# Altium schematic sheet I2C_system.schdoc: TEBF0808 - I2C System
size A4; DocumentNumber: TEBF0808; Revision: 04; SheetNumber: 21; SheetTotal: 36; Date: 2016-09-29; CompanyName: Trenz Electronic GmbH; Organization: Trenz Electronic GmbH
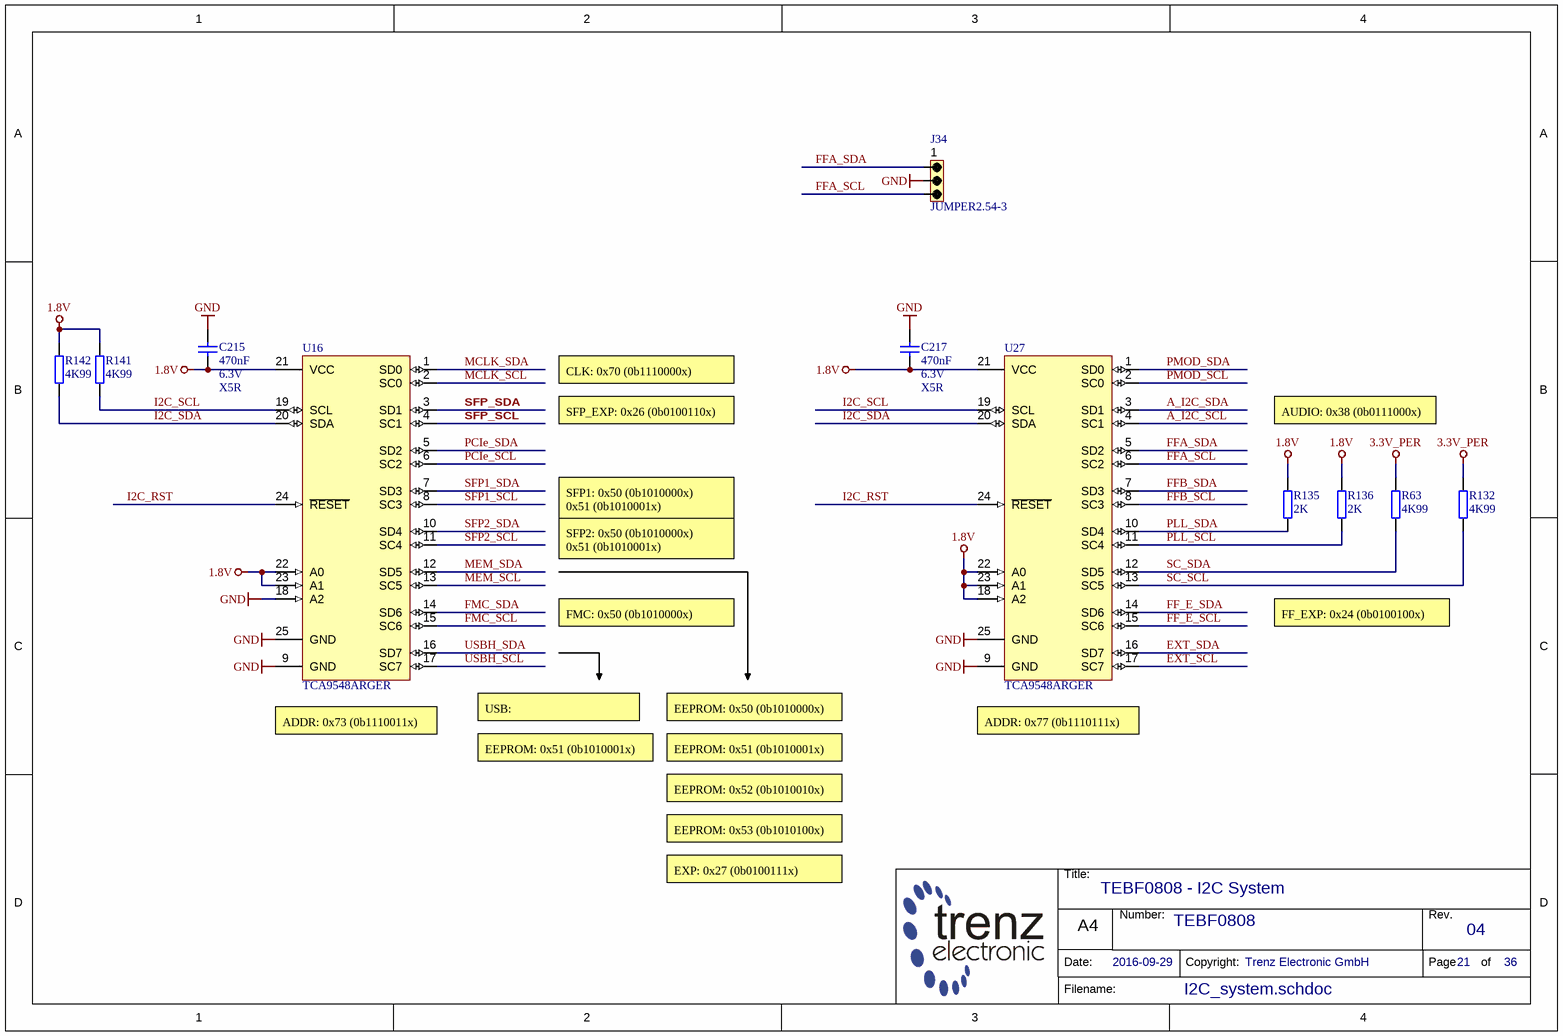
[diagram p0: I2C_system.schdoc]

## Parts
C215  470nF  Voltage: 6.3V  Technology: X5R  [CAPC1005X55N]
C217  470nF  Voltage: 6.3V  Technology: X5R  [CAPC1005X55N]
J34  JUMPER2.54-3  [JUMPER2_54-3]
R63  4K99  [RESC1005X40N]
R132  4K99  [RESC1005X40N]
R135  2K  [RESC1005X40N]
R136  2K  [RESC1005X40N]
R141  4K99  [RESC1005X40N]
R142  4K99  [RESC1005X40N]
U16  TCA9548ARGER  [QFN50P400X400X100-25N-220]
U27  TCA9548ARGER  [QFN50P400X400X100-25N-220]

## Nets
1.8V: C215.2 C217.2 R135.2 R136.2 R141.1 R142.1 U16.21(VCC) U16.22(A0) U16.23(A1) U27.18(A2) U27.21(VCC) U27.22(A0) U27.23(A1)
3.3V_PER: R63.1 R132.1
GND: C215.1 C217.1 J34.2 U16.9(GND) U16.18(A2) U16.25(GND) U27.9(GND) U27.25(GND)
A_I2C_SCL: U27.4(SC1)
A_I2C_SDA: U27.3(SD1)
EXT_SCL: U27.17(SC7)
EXT_SDA: U27.16(SD7)
FF_E_SCL: U27.15(SC6)
FF_E_SDA: U27.14(SD6)
FFA_SCL: J34.3 U27.6(SC2)
FFA_SDA: J34.1 U27.5(SD2)
FFB_SCL: U27.8(SC3)
FFB_SDA: U27.7(SD3)
FMC_SCL: U16.15(SC6)
FMC_SDA: U16.14(SD6)
I2C_RST: U16.24(~{RESET}) U27.24(~{RESET})
I2C_SCL: R141.2 U16.19(SCL) U27.19(SCL)
I2C_SDA: R142.2 U16.20(SDA) U27.20(SDA)
MCLK_SCL: U16.2(SC0)
MCLK_SDA: U16.1(SD0)
MEM_SCL: U16.13(SC5)
MEM_SDA: U16.12(SD5)
PCIe_SCL: U16.6(SC2)
PCIe_SDA: U16.5(SD2)
PLL_SCL: R136.1 U27.11(SC4)
PLL_SDA: R135.1 U27.10(SD4)
PMOD_SCL: U27.2(SC0)
PMOD_SDA: U27.1(SD0)
SC_SCL: R132.2 U27.13(SC5)
SC_SDA: R63.2 U27.12(SD5)
SFP1_SCL: U16.8(SC3)
SFP1_SDA: U16.7(SD3)
SFP2_SCL: U16.11(SC4)
SFP2_SDA: U16.10(SD4)
SFP_SCL: U16.4(SC1)
SFP_SDA: U16.3(SD1)
USBH_SCL: U16.17(SC7)
USBH_SDA: U16.16(SD7)

## Notes on the sheet
- CLK: 0x70 (0b1110000x)
- SFP_EXP: 0x26 (0b0100110x)
- AUDIO: 0x38 (0b0111000x)
- SFP1: 0x50 (0b1010000x)
  0x51 (0b1010001x)
- SFP2: 0x50 (0b1010000x)
  0x51 (0b1010001x)
- FMC: 0x50 (0b1010000x)
- FF_EXP: 0x24 (0b0100100x)
- USB:
- EEPROM: 0x50 (0b1010000x)
- (near U16) ADDR: 0x73 (0b1110011x)
- EEPROM: 0x51 (0b1010001x)
- (near U27) ADDR: 0x77 (0b1110111x)
- EEPROM: 0x53 (0b1010100x)
- EEPROM: 0x52 (0b1010010x)
- EXP: 0x27 (0b0100111x)
- Title:
- Number:
- Rev.
- Date:
- A4
- Copyright:
- Page
- of
- Filename:

## Library data of the parts
C215 C217 = 23659: KON 470nF 6,3V X5R SMD; AN: 23659; Mixed: SMT; Value: 470n; Preferred: Yes; Case: 1005 (0402)
J34 = 22328: Stiftleiste gerade 1-reihig, 3pol.; AN: 22328; Mixed: THT; Trenz-Stock: Yes
R63 R132 R141 R142 = 22754: WID SMD 4K99 1% 0,063W; AN: 22754; Value: 4.99K; Mixed: SMT; Preferred: Yes; Case: 1005 (0402); Tolerance: 1%; Technology: TK100
R135 R136 = 25073: WID SMD 2K 1% 0,063W; AN: 25073; Mixed: SMT; Tolerance: 1%; Case: 1005 (0402); Technology: TK100; Value: 2K
U16 U27 = 26513: AN: 26513; Mixed: SMT; Case: QFN24 RGE; HelpURL: B:\ad\adlib\datasheet\TCA9548A; H-ART: TCA9548ARGER